# Altium schematic sheet OLED.SchDoc
size B; SheetNumber: 14; SheetTotal: 15
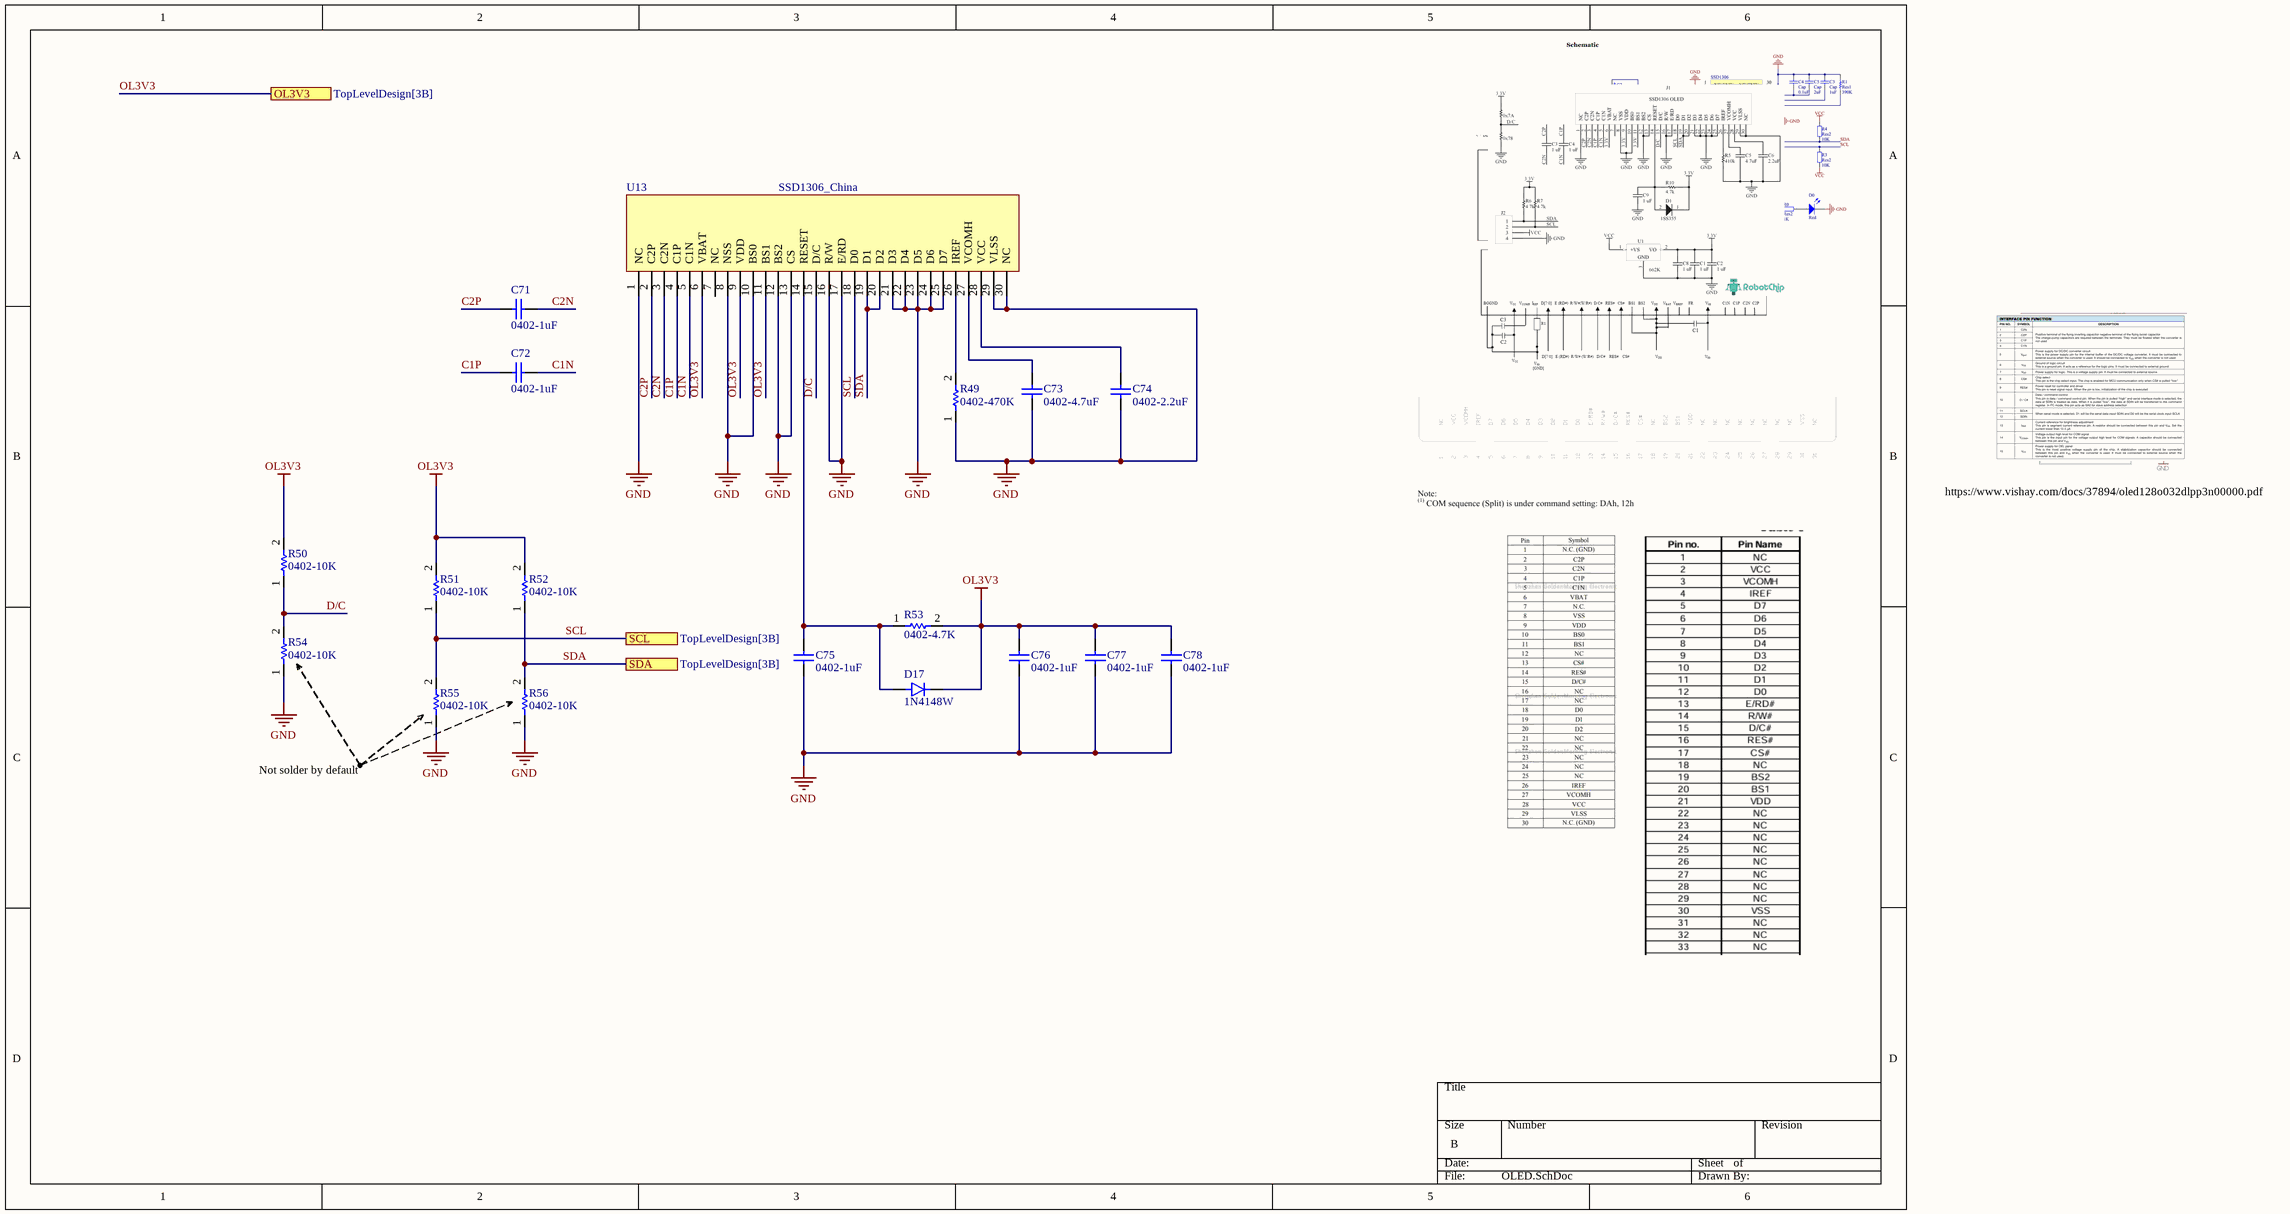
[diagram p0: OLED.SchDoc]

## Parts
C71  0402-1uF  [CAPC0402(1005)60_N]
C72  0402-1uF  [CAPC0402(1005)60_N]
C73  0402-4.7uF  [CAPC0402(1005)60_N]
C74  0402-2.2uF  [CAPC0402(1005)60_N]
C75  0402-1uF  [CAPC0402(1005)60_N]
C76  0402-1uF  [CAPC0402(1005)60_N]
C77  0402-1uF  [CAPC0402(1005)60_N]
C78  0402-1uF  [CAPC0402(1005)60_N]
D17  1N4148W  [SODFL3816X120N]
R49  0402-470K  [R-0402-10K]
R50  0402-10K  [R-0402-10K]
R51  0402-10K  [R-0402-10K]
R52  0402-10K  [R-0402-10K]
R53  0402-4.7K  [R-0402-10K]
R54  0402-10K  [R-0402-10K]
R55  0402-10K  [R-0402-10K]
R56  0402-10K  [R-0402-10K]
U13  SSD1306_China  [SSD1306_China-Footprint-1]

## Ports
OL3V3 (see TopLevelDesign[3B]), SCL (see TopLevelDesign[3B]), SDA (see TopLevelDesign[3B])

## Nets
GND: C73.1 C74.1 C75.1 C76.1 C77.1 C78.1 R49.1 R54.1 R55.1 R56.1 U13.1(NC) U13.8(NSS) U13.10(BS0) U13.12(BS2) U13.13(CS) U13.16(R/W) U13.17(E/RD) U13.21(D3) U13.22(D4) U13.23(D5) U13.24(D6) U13.25(D7) U13.29(VLSS) U13.30(NC)
OL3V3: C76.2 C77.2 C78.2 D17.C(K) R50.2 R51.2 R52.2 R53.2 U13.6(VBAT) U13.9(VDD) U13.11(BS1) ; port OL3V3
C1N: C72.1 U13.5(C1N)
C1P: C72.2 U13.4(C1P)
C2N: C71.1 U13.3(C2N)
C2P: C71.2 U13.2(C2P)
D/C: R50.1 R54.2 U13.15(D/C)
SCL: R51.1 R55.2 U13.18(D0) ; port SCL
SDA: R52.1 R56.2 U13.19(D1) U13.20(D2) ; port SDA
NetC73_2: C73.2 U13.27(VCOMH)
NetC74_2: C74.2 U13.28(VCC)
NetC75_2: C75.2 D17.A R53.1 U13.14(RESET)
NetR49_2: R49.2 U13.26(IREF)

Not connected (* = marked no-connect by the designer): U13 7(NC)

## Notes on the sheet
- https://www.vishay.com/docs/37894/oled128o032dlpp3n00000.pdf
- Not solder by default

## Library data of the parts
C71 C72 C75-C78 = CMP-001-00353-3: Capacitor 1uF 0402s; Voltage Rating: 4V; Value: 1µF; Tolerance: 20%; Dielectric: X5R; Pins: 2; Component Type: Standard; Packaging: Tape and Reel; Min Operating Temperature: -55°C; Voltage Rating (DC): 4V; Series: M; Height: 0.5mm; RoHS Compliant: Yes; Case/Package: 0402; Thickness: 0.028inch; Design Item ID: CMP-1034-02139-2; Length: 0.039inch; Max Operating Temperature: 85°C; Termination: SMD/SMT; Package Quantity: 1; Width: 0.02inch; Halogen Free: Halogen Free; Source: 0402-10uF.SchLib; Construction: Flat; Mount: Surface Mount; Case Code (Metric): 1005
C73 = CMP-001-00364-1: Capacitor 4.7uF 0402; Voltage Rating: 4V; Tolerance: 20%; Dielectric: X5R; Value: 4.7µF; Series: M; Width: 0.02inch; Halogen Free: Halogen Free; Construction: Flat; Pins: 2; Min Operating Temperature: -55°C; RoHS Compliant: Yes; Max Operating Temperature: 85°C; Thickness: 0.028inch; Package Quantity: 1; Mount: Surface Mount; Component Type: Standard; Packaging: Tape and Reel; Case Code (Metric): 1005; Case/Package: 0402; Voltage Rating (DC): 4V; Length: 0.039inch; Source: 0402-10uF.SchLib; Termination: SMD/SMT; Design Item ID: CMP-1034-02139-2; Height: 0.5mm
C74 = CMP-001-00356-1: Capacitor 2.2uF 0402; Voltage Rating (DC): 4V; Value: 2.2µF; Tolerance: 20%; Dielectric: X5R; Case/Package: 0402; Height: 0.5mm; Component Type: Standard; RoHS Compliant: Yes; Max Operating Temperature: 85°C; Thickness: 0.028inch; Series: M; Length: 0.039inch; Construction: Flat; Voltage Rating: 4V; Design Item ID: CMP-1034-02139-2; Case Code (Metric): 1005; Packaging: Tape and Reel; Mount: Surface Mount; Halogen Free: Halogen Free; Width: 0.02inch; Termination: SMD/SMT; Package Quantity: 1; Source: 0402-10uF.SchLib; Pins: 2; Min Operating Temperature: -55°C
D17 = CMP-004-00119-1: Value: *; Price: None; Source: 1N4148W.SchLib; MP: 1N4148W; Pins: 2; Package: None; Design Item ID: 1N4148W; Availability: Unavailable; Component Type: Standard
R49 = CMP-009-00676-1: RES 0402 470K; Value: 470k
R50-R52 R54-R56 = CMP-009-00675-4: RES 0402 10K; Value: 10k
R53 = CMP-009-00687-2: RES 0402 4.7K; Value: 4.7k
U13 = CMP-00001-1: SSD1306_China , 0.96 inch display